# EasyEDA Pro project ProProject_Driver_STM32F031_2023-10-07.epro, board PCB1_3
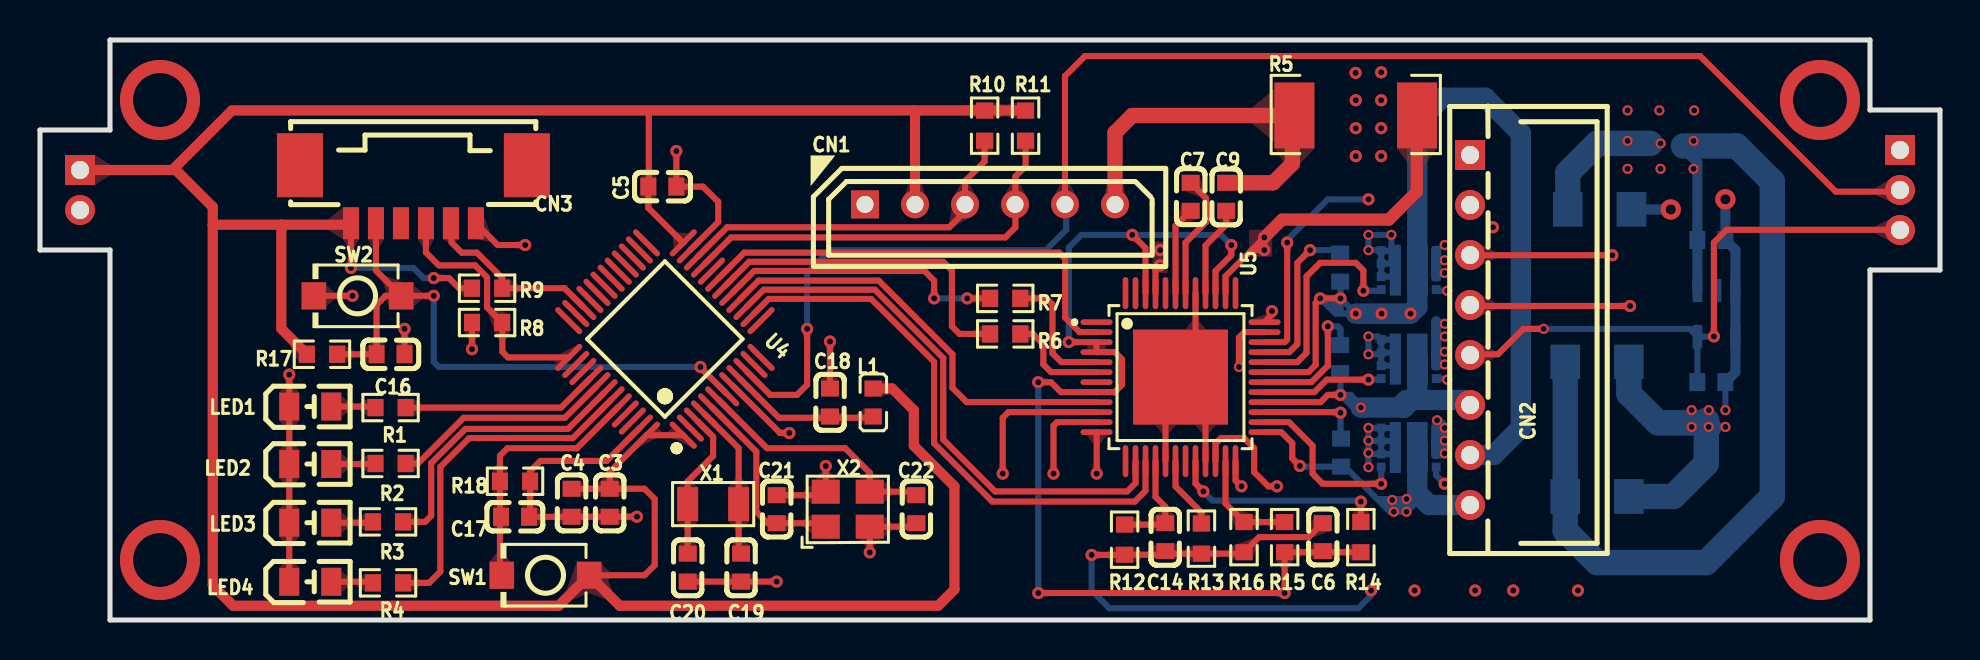
[diagram p10: board, top side]
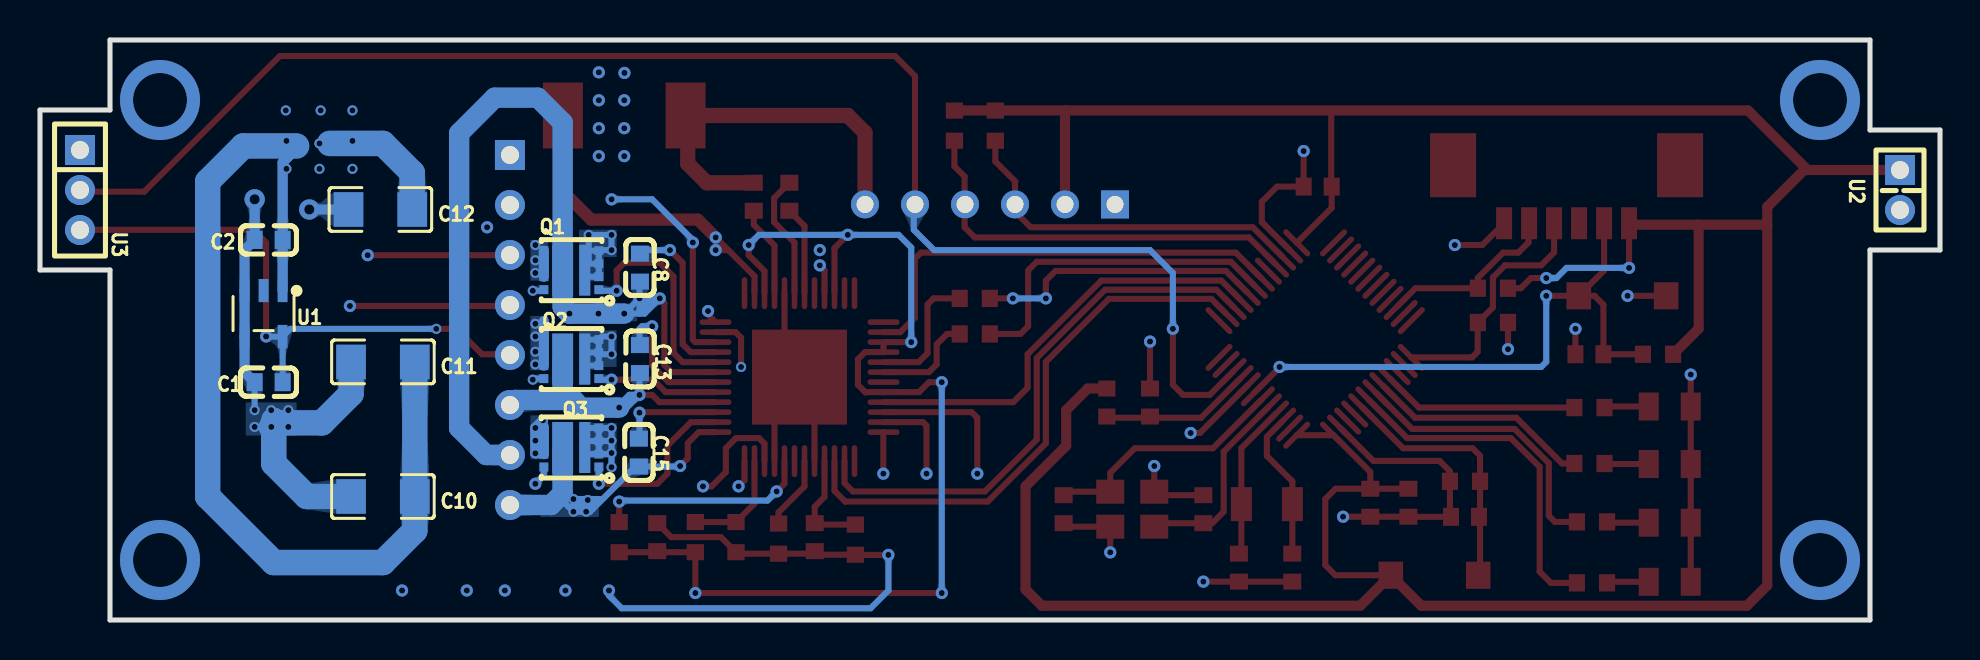
[diagram p11: board, bottom side, seen from below]

Outline 95 x 29 mm; copper layers: Top Layer, Inner1, Inner2, Bottom Layer. Coordinates in mm from the lower left corner of the outline.
Outline path: 0,24.5 0,18.5 3.5,18.5 3.5,0 91.5,0 91.5,17.5 95,17.5 95,25.5 91.5,25.5 91.5,29 3.5,29 3.5,24.5 0,24.5
Stack: Top Layer 0.035mm / Dielectric1 0.48mm PP er 4.5 / Inner1 0.035mm / Dielectric2 0.48mm FR4 er 4.5 / Inner2 0.035mm / Dielectric3 0.48mm PP er 4.5 / Bottom Layer 0.035mm

## Design rules (mm)
spacing safeClearance (default): track to track 0.152, other pairs 0.152 to 0.3
track width trackWidth (default): min 0.127, default 0.254, max 2.54
differential pair differentialPair (default): width min 0.127, default 0.254, max 2.54; gap min 0.152, default 0.152
via viaSize (default): diameter min 0.5, default 0.61, max 10; hole min 0.3, default 0.305, max 6
net GND uses copperRegion1
net VCC uses copperRegion1
net $1N6958 uses copperRegion1
net GND_CS uses copperRegion1
net +16V uses copperRegion1

## Placement (name value [footprint] x y rotation side)
C1  4.7uF  [C0603]  83.57 11.89 180 bottom
C2  10uF  [C0603]  83.57 19 180 bottom
C3  100nF  [C0603]  28.49 5.86 90 top
C4  100nF  [C0603]  26.58 5.86 90 top
C5  100nF  [C0603]  31.12 21.67 180 top
C6  1uF  [C0603]  64.14 4.14 270 top
C7  470nF  [C0603]  57.53 21.16 270 top
C8  33nF  [C0603]  65 17.62 270 bottom
C9  1uF  [C0603]  59.31 21.16 90 top
C10  10uF  [C1206]  77.85 6.17 180 bottom
C11  10uF  [C1206]  77.85 12.91 180 bottom
C12  10uF  [C1206]  77.98 20.53 180 bottom
C13  33nF  [C0603]  65 13.05 270 bottom
C14  1nF  [C0603]  56.26 4.14 90 top
C15  33nF  [C0603]  65.06 8.37 270 bottom
C16  100nF  [C0603]  17.53 13.29 180 top
C17  100nF  [C0603]  23.75 5.16 0 top
C18  100nF  [C0603]  39.5 10.87 270 top
C19  22pF  [c0603]  35.05 2.62 90 top
C20  22pF  [C0603]  32.39 2.62 90 top
C21  20pF  [c0603]  36.83 5.54 270 top
C22  20pF  [C0603]  43.82 5.54 270 top
CN1  HC-5264-6A  [CONN-TH_6P-P2.50_HCTL_HC-5264-6A]  47.5 20.78 0 top
CN2  HC-5264-8AW  [CONN-TH_8P-P2.50_HC-5264-8AW]  71.5 14.5 90 top
CN3  532610671  [CONN-SMD_6P-P1.25_53261-0671]  18.67 21.29 180 top
L1  3.3uH  [L0603]  41.66 10.87 270 top
LED1  SZYY0805B  [LED0805-R-RD_BLUE]  13.51 10.67 0 top
LED2  SZYY0805B  [LED0805-R-RD_BLUE]  13.51 7.8 0 top
LED3  SZYY0805B  [LED0805-R-RD_BLUE]  13.51 4.87 0 top
LED4  SZYY0805B  [LED0805-R-RD_BLUE]  13.51 1.91 0 top
Q1  DMT3009LDT-7  [V-DFN3030-8K_L3.0-W3.0-P0.65-BL]  68.43 17.49 90 bottom
Q2  DMT3009LDT-7  [V-DFN3030-8K_L3.0-W3.0-P0.65-BL]  68.43 13.05 90 bottom
Q3  DMT3009LDT-7  [V-DFN3030-8K_L3.0-W3.0-P0.65-BL]  68.43 8.62 90 bottom
R1  1kΩ  [R0603]  17.53 10.62 0 top
R2  1kΩ  [R0603]  17.53 7.83 0 top
R3  1kΩ  [R0603]  17.4 4.91 0 top
R4  1kΩ  [R0603]  17.4 1.86 0 top
R5  25mΩ  [RES-SMD_L6.4-W3.2-R2512]  65.79 25.22 0 top
R6  1kΩ  [R0603]  48.26 14.3 0 top
R7  1kΩ  [R0603]  48.26 16.08 0 top
R8  10kΩ  [R0603]  22.35 14.87 0 top
R9  10kΩ  [R0603]  22.35 16.59 0 top
R10  1kΩ  [R0603]  47.23 24.72 270 top
R11  1kΩ  [R0603]  49.28 24.72 270 top
R12  47kΩ  [R0603]  54.23 4.02 90 top
R13  10kΩ  [R0603]  58.07 4.07 270 top
R14  100kΩ  [R0603]  66.04 4.14 90 top
R15  100kΩ  [R0603]  62.23 4.14 90 top
R16  10kΩ  [R0603]  60.2 4.14 90 top
R17  10kΩ  [R0603]  14.1 13.29 180 top
R18  10kΩ  [R0603]  23.75 6.94 0 top
SW1  TS-1088-AR02016  [SW-SMD_L3.9-W3.0-P4.45]  25.28 2.24 180 top
SW2  TS-1088-AR02016  [SW-SMD_L3.9-W3.0-P4.45]  15.88 16.21 180 top
U1  TPS7B6950DBVR  [SOT-23-5_L3.0-W1.7-P0.95-LS2.8-BL]  83.82 15.32 0 bottom
U2  DW200R-11-02-43  [HDR-TH_2P-P2.00-V-F]  2 21.5 270 bottom
U3  PM200-1-03-Z-4.3  [HDR-TH_3P-P2.00-V-F-A]  93 21.5 270 bottom
U4  STM32F031C6T6TR  [LQFP-48_L7.0-W7.0-P0.50-LS9.0-TL]  31.24 14.05 135 top
U5  A3930KJPTR-T  [LQFP-48_L7.0-W7.0-P0.50-LS9.0-BL-EP]  57.03 12.14 270 top
X1  32.768kHz  [CRYSTAL-SMD_L3.2-W1.5-1]  33.66 5.79 180 top
X2  8MHz  [OSC-SMD_4P-L3.2-W2.5-BL]  40.39 5.54 0 top

## Footprints (pads in the part's own frame, mm; a bottom-side part is the same pattern mirrored in y, then rotated)
c0603
  rect 0.8x0.9 smd: 1(-0.7,0) 2(0.7,0)
C0603
  rect 0.8x0.9 smd: 1(-0.7,0) 2(0.7,0)
C1206
  rect 1.485x1.728 smd: 1(-1.593,0) 2(1.593,0)
CONN-SMD_6P-P1.25_53261-0671
  rect 0.8x1.6 smd: 1(3.124,1.45) 2(1.875,1.45) 3(0.625,1.45) 4(-0.625,1.45) 5(-1.875,1.45) 6(-3.124,1.45)
  rect 2.301x3.2 smd: 7(-5.675,-1.45) 8(5.675,-1.45)
CONN-TH_6P-P2.50_HCTL_HC-5264-6A
  rect 1.4x1.4 hole 0.85: 1(-6.25,0)
  round 1.4 hole 0.85: 2(-3.75,0) 3(-1.25,0) 4(1.25,0) 5(3.75,0) 6(6.25,0)
CONN-TH_8P-P2.50_HC-5264-8AW
  rect 1.5x1.5 hole 0.9: 1(8.75,0)
  round 1.5 hole 0.9: 2(6.25,0) 3(3.75,0) 4(1.25,0) 5(-1.25,0) 6(-3.75,0) 7(-6.25,0) 8(-8.75,0)
CRYSTAL-SMD_L3.2-W1.5-1
  rect 1.05x1.7 smd: 1(-1.275,0) 2(1.275,0)
HDR-TH_2P-P2.00-V-F
  rect 1.5x1.5 hole 0.9: 1(-1,0)
  round 1.5 hole 0.9: 2(1,0)
HDR-TH_3P-P2.00-V-F-A
  rect 1.5x1.5 hole 0.9: 1(-2,0)
  round 1.5 hole 0.9: 2(0,0) 3(2,0)
L0603
  rect 0.8x0.864 smd: 1(-0.7,0) 2(0.7,0)
LED0805-R-RD_BLUE
  rect 1.001x1.399 smd: 1(1.052,0) 2(-1.049,0)
LQFP-48_L7.0-W7.0-P0.50-LS9.0-BL-EP
  oval 0.28x1.6 smd: 1(-2.75,-4.2) 2(-2.25,-4.2) 3(-1.75,-4.2) 4(-1.25,-4.2) 5(-0.75,-4.2) 6(-0.25,-4.2) 7(0.25,-4.2) 8(0.75,-4.2) 9(1.25,-4.2) 10(1.75,-4.2) 11(2.25,-4.2) 12(2.75,-4.2) 25(2.75,4.2) 26(2.25,4.2) 27(1.75,4.2) 28(1.25,4.2) 29(0.75,4.2) 30(0.25,4.2) 31(-0.25,4.2) 32(-0.75,4.2) 33(-1.25,4.2) 34(-1.75,4.2) 35(-2.25,4.2) 36(-2.75,4.2)
  oval 1.6x0.28 smd: 13(4.2,-2.75) 14(4.2,-2.25) 15(4.2,-1.75) 16(4.2,-1.25) 17(4.2,-0.75) 18(4.2,-0.25) 19(4.2,0.25) 20(4.2,0.75) 21(4.2,1.25) 22(4.2,1.75) 23(4.2,2.25) 24(4.2,2.75) 37(-4.2,2.75) 38(-4.2,2.25) 39(-4.2,1.75) 40(-4.2,1.25) 41(-4.2,0.75) 42(-4.2,0.25) 43(-4.2,-0.25) 44(-4.2,-0.75) 45(-4.2,-1.25) 46(-4.2,-1.75) 47(-4.2,-2.25) 48(-4.2,-2.75)
  rect 4.75x4.75 smd: 49(0,0)
LQFP-48_L7.0-W7.0-P0.50-LS9.0-TL
  oval 1.8x0.28 smd: 1(-4.05,2.75) 2(-4.05,2.25) 3(-4.05,1.75) 4(-4.05,1.25) 5(-4.05,0.75) 6(-4.05,0.25) 7(-4.05,-0.25) 8(-4.05,-0.75) 9(-4.05,-1.25) 10(-4.05,-1.75) 11(-4.05,-2.25) 12(-4.05,-2.75) 25(4.05,-2.75) 26(4.05,-2.25) 27(4.05,-1.75) 28(4.05,-1.25) 29(4.05,-0.75) 30(4.05,-0.25) 31(4.05,0.25) 32(4.05,0.75) 33(4.05,1.25) 34(4.05,1.75) 35(4.05,2.25) 36(4.05,2.75)
  oval 0.28x1.8 smd: 13(-2.75,-4.05) 14(-2.25,-4.05) 15(-1.75,-4.05) 16(-1.25,-4.05) 17(-0.75,-4.05) 18(-0.25,-4.05) 19(0.25,-4.05) 20(0.75,-4.05) 21(1.25,-4.05) 22(1.75,-4.05) 23(2.25,-4.05) 24(2.75,-4.05) 37(2.75,4.05) 38(2.25,4.05) 39(1.75,4.05) 40(1.25,4.05) 41(0.75,4.05) 42(0.25,4.05) 43(-0.25,4.05) 44(-0.75,4.05) 45(-1.25,4.05) 46(-1.75,4.05) 47(-2.25,4.05) 48(-2.75,4.05)
OSC-SMD_4P-L3.2-W2.5-BL
  rect 1.4x1.2 smd: 1(-1.1,-0.875) 2(1.1,-0.875) 3(1.1,0.875) 4(-1.1,0.875)
R0603
  rect 0.806x0.864 smd: 1(-0.753,0) 2(0.753,0)
RES-SMD_L6.4-W3.2-R2512
  rect 2x3.3 smd: 1(-3.067,0) 2(3.067,0)
SOT-23-5_L3.0-W1.7-P0.95-LS2.8-BL
  rect 0.49x1.157 smd: 1(-0.95,-1.153) 2(0,-1.153) 3(0.95,-1.153)
  rect 0.49x1.175 smd: 4(0.95,1.153) 5(-0.95,1.153)
SW-SMD_L3.9-W3.0-P4.45
  rect 1.23x1.36 smd: 1(-2.185,0) 2(2.185,0)
V-DFN3030-8K_L3.0-W3.0-P0.65-BL
  rect 0.45x0.45 smd: 1(-0.975,-1.375) 2(-0.325,-1.375) 3(0.325,-1.375) 4(0.975,-1.375) 5(0.975,1.375) 6(0.325,1.375) 7(-0.325,1.375) 8(-0.975,1.375)
  rect 2.55x1.044 smd: 9(0,0.433)
  rect 2.55x0.556 smd: 10(0,-0.672)

## Nets
As in the schematic.

Pads without a net: CN3 3 7 8; U1 2; U4 2 11 20 25 26 27 28 29 30 31 32 33 35 36 38 39 45 46; U5 1 7 13 19 37 44 47 48

## Via types
v1: diameter 4, hole 2.7, Top Layer to Bottom Layer, 4 vias
v2: diameter 0.61, hole 0.305, Top Layer to Bottom Layer, 71 vias
v3: diameter 0.508, hole 0.3, Top Layer to Bottom Layer, 44 vias
v4: diameter 1.016, hole 0.508, Top Layer to Bottom Layer, 2 vias

## Routing (per net, layer and track width the routed paths; a pad name or vN(x,y) marks a point on that pad's centre or on a via; arc(x,y) is an arc through that point)
+5V: length 29.4
  Top Layer w0.305: 71.5,13.29 72.9,13.29 74.17,14.56 v3(75.19,14.56) ; 93,19.51 84.33,19.51 83.69,18.88 v2(83.69,14.18)
  Bottom Layer w0.305: C1.2 82.87,14.17 ; v2(83.69,14.18) 83.68,14.17 U1.5 82.48,14.56 v3(75.19,14.56)
+16V: length 80
  Top Layer w0.305: U5.24 59.78,6.98 v2(60.07,6.68) ; U5.45 55.78,17.5 v2(56.01,17.73)
  Inner2 w0.305: v3(66.42,14.18) v3(66.42,13.29)
  Bottom Layer w0.305: 67.06,18.46 67.03,18.49 v3(66.42,18.49) v3(66.42,19.26) v3(67.57,19.26) 67.57,18.46 ; 67.06,18.46 67.57,18.46 ; 67.06,18.46 Q1.3 ; 67.06,18.46 Q1.4 ; 66.42,8.3 Q3.2 ; 66.42,8.3 v3(66.42,8.35) 66.42,8.95 ; 66.42,8.3 v3(66.42,7.64) ; Q3.2 Q3.3 ; Q3.2 67.76,8.3 ; Q1.3 Q1.2 67.76,17.17 ; Q1.3 67.57,17.82 ; 67.06,14.02 Q2.4 67.06,14.02 ; 67.06,14.02 67.06,14.02 ; 67.06,14.02 66.9,14.18 v3(66.42,14.18) v3(66.42,13.29) 66.98,13.29 67.06,13.37 ; 67.06,14.02 Q2.3 ; 67.06,14.02 67.76,14.02 ; 66.42,8.95 Q3.3 ; 66.42,8.95 v3(66.42,8.97) v3(66.42,9.6) 66.43,9.6 Q3.4 ; Q3.3 Q3.4 ; Q3.3 67.76,8.95 ; 67.06,13.37 Q2.2 67.76,12.72 ; 67.06,13.37 Q2.3 ; 67.57,17.82 67.76,17.82 ; 67.57,17.82 67.57,18.46 ; 67.57,18.46 67.76,18.46 ; Q3.4 67.76,9.6 ; 67.71,13.37 67.76,13.32 67.76,13.05 ; 67.71,13.37 Q2.3 ; 67.71,13.37 67.76,13.37
  Bottom Layer w0.508: 82.3,23.45 82.87,22.88 C2.2 82.87,16.47
  Bottom Layer w1.27: 80.52,23.83 77.85,23.83 76.39,22.36 C12.2 ; C11.2 C10.2 76.26,4.47 77.85,2.87 83.31,2.87 86.62,6.17 86.62,21.92 84.84,23.7 82.17,23.7
  vias: v2(56.01,18.49) v3(79.38,25.48) v3(79.38,23.95) v3(79.38,22.56) v3(80.97,25.48) v3(81.03,23.83) v3(81.03,22.56) v3(82.71,25.48) v3(82.68,23.95) v3(82.68,22.56)
GND: length 143.3
  Top Layer w0.305: CN3.6 22.89,18.75 v2(24.26,18.75) ; v2(37.47,9.35) 37,9.35 U4.8 ; v2(36.83,1.92) C19.1 C20.1 ; C14.1 56.39,3.32 R13.2 60.2,3.32 ; 24.5,5.16 26.58,5.16 C4.1 C3.1 v2(29.85,5.16) ; 24.5,5.16 C17.2 ; 24.5,5.16 R18.2 24.5,7.44 25.02,7.95 28.33,7.95 U4.47 ; R16.1 60.95,4.14 63.44,4.14 C6.1 ; SW2.2 v2(15.62,16.21) ; v2(52.58,3.25) 54.22,3.25 R12.1 56.26,3.26 ; v2(12.46,12.27) LED1.2 LED2.2 LED3.2 LED4.2 ; v2(41.49,3.38) X2.2 43.82,4.67 ; C16.1 v2(18.23,14.56) ; U4.23 33.91,19.9 33.91,20.91 33.15,21.67 C5.1 v2(31.82,23.45) ; X2.4 v2(39.29,7.7) ; C21.1 39.29,6.24 ; U5.41 57.78,12.14 ; U5.21 58.28,12.14 ; U5.17 56.28,12.14 ; R8.1 v2(21.6,13.54) ; C18.1 v2(39.5,13.92)
  Top Layer w0.762: C9.2 61.66,21.86 62.61,22.81 62.61,25.22 ; 62.61,25.22 54.61,25.22 53.75,24.36 CN1.6 ; 62.61,25.22 R5.1
  Bottom Layer w0.305: v2(66.55,1.48) 66.55,1.22 65.91,0.59 53.47,0.59 52.58,1.48 v2(52.58,3.25) ; C1.1 v3(84.27,10.49)
  Bottom Layer w0.508: v4(84.27,21.03) C2.1 84.77,18.5 U1.3 U1.4 84.77,12.39 C1.1 ; v4(81.54,20.53) C12.1
  Bottom Layer w1.27: 83.31,9.78 v3(83.44,9.65) ; 83.31,9.78 83.23,9.86 80.9,9.86 79.45,11.31 C11.1 ; 83.31,9.78 83.31,7.83 81.66,6.17 C10.1 ; 83.31,9.78 83.31,9.98
  vias: v2(68.73,1.48) v2(71.76,1.48) v2(73.66,1.48) v2(76.9,1.48) v3(82.58,10.49) v3(82.58,9.65) v3(83.44,10.49) v3(84.27,9.65)
GND_CS: length 42.5
  Top Layer w0.305: 60.58,18.49 59.28,17.19 U5.38 ; 60.58,18.49 v2(61.22,18.49) v2(61.22,19.13) 60.58,18.49 ; v2(61.85,6.68) 61.42,6.68 60.71,7.39 60.71,8.59 60.2,9.1 59.05,9.1 58.78,8.82 U5.22
  Top Layer w0.61: v2(61.22,19.13) 62.1,20.02 67.44,20.02 68.84,21.42 68.84,25.22
  Inner1 w0.305: v2(61.85,6.68) 61.85,9.1 60.84,10.11 60.84,17.22 61.22,17.61 v2(61.22,18.49)
  Bottom Layer w0.508: 69.81,14.94 Q2.5 Q2.6 Q2.7 ; v3(69.85,9.98) v3(70.23,9.6) v3(70.23,8.97) v3(70.23,8.33) 69.84,8.33 Q3.7 Q3.6 Q3.5 ; Q1.7 Q1.6 Q1.5
  vias: v2(65.78,27.35) v2(65.79,25.99) v2(65.79,24.59) v2(65.79,23.19) v2(67.06,27.38) v2(67.06,25.99) v2(67.06,24.59) v2(67.06,23.19) v3(70.23,18.75) v3(70.23,17.99) v3(70.23,17.35) v3(70.23,14.81) v3(70.23,14.18) v3(70.23,13.41) v3(70.23,12.78)
VCC: length 172.7
  Top Layer w0.305: C3.2 28.49,7.4 U4.48 U4.1 ; C3.2 C4.2 ; C3.2 30.22,6.56 30.74,6.05 30.74,2.75 30.23,2.24 SW1.1 ; CN3.1 v2(15.55,17.61) ; v2(19.69,17.1) 20.45,17.1 20.96,16.59 R9.1 ; U4.24 30.42,20.6 C5.2 30.44,21.69 30.44,25.42
  Top Layer w0.508: R11.1 49.27,25.48 43.69,25.48 ; 12.07,19.76 12.07,14.57 R17.2 ; 12.07,19.76 8.64,19.76 ; 12.07,19.76 15.55,19.76 ; 43.69,25.48 43.75,25.42 CN1.2 ; 43.69,25.48 9.6,25.48 6.62,22.5 ; 8.64,19.76 8.64,20.65 6.79,22.5 6.62,22.5 ; 8.64,19.76 8.64,1.73 9.65,0.71 25.94,0.71 SW1.1 28.98,0.71 44.91,0.71 45.72,1.53 45.72,6.68 43.69,8.72 43.69,10.49 42.61,11.57 L1.1 ; 6.62,22.5 U2.1
  Bottom Layer w0.305: v2(19.69,17.1) 19.18,17.1 18.67,17.61 v2(15.55,17.61)
VDDA: length 7.5
  Top Layer w0.305: 41.66,10.11 36.95,10.11 34.99,12.07
(no net):
  vias: v1(6,26) v1(6,3) v1(89,26) v1(89,3)
32_IN: length 7.5
  Top Layer w0.305: U4.3 33.66,9.16 33.66,8.21 32.38,6.93 X1.2 32.38,3.32
32_OUT: length 7.7
  Top Layer w0.305: 34.93,3.32 X1.1 34.93,8.59 U4.4
BOOT0: length 12.9
  Top Layer w0.305: 23,2.24 23,5.11 C17.1 ; 28.91,10.66 26.84,8.59 23.37,8.59 23,8.22 R18.1 23,5.16
CA: length 8.3
  Top Layer w0.305: U5.33 62.47,13.39 62.87,13.8 62.87,17.86 v2(63.5,18.49)
  Bottom Layer w0.305: v2(63.5,18.49) 64.88,18.49 65,18.37
CB: length 7
  Top Layer w0.305: v2(64.39,14.68) 64.39,12.71 63.57,11.89 U5.30
  Bottom Layer w0.305: v2(64.39,14.68) 64.9,14.68 65.03,14.56 65.03,13.75
CC: length 5.1
  Top Layer w0.305: v2(65.03,10.37) 65,10.39 U5.27
  Bottom Layer w0.305: v2(65.03,10.37) 65.03,9.07
DIR: length 21.7
  Top Layer w0.305: 52.82,10.89 46.34,10.89 45.62,11.61 45.62,13.28 41.94,16.97 35.93,16.97 U4.16
FF1: length 16.8
  Top Layer w0.305: R6.1 45.98,14.3 45.59,14.68 45.59,17.48 45.16,17.91 35.46,17.91 U4.18
FF2: length 14.4
  Top Layer w0.305: v2(46.36,16.08) R7.1 ; U4.17 35.71,17.45 44.22,17.45 44.71,16.97 v2(44.71,16.08)
  Bottom Layer w0.305: v2(46.36,16.08) v2(44.71,16.08)
GHA: length 11.3
  Top Layer w0.305: U5.32 62.86,12.89 63.32,13.36 63.32,17.17 64.01,17.86 65.79,17.86 66.17,17.48 v2(66.17,16.46)
  Bottom Layer w0.305: v2(66.17,16.46) 67.06,16.46
GHB: length 6.1
  Top Layer w0.305: v2(66.42,12.02) 64.34,12.02 63.72,11.39 U5.29
  Bottom Layer w0.305: v2(66.42,12.02) 67.06,12.02
GHC: length 8.8
  Top Layer w0.305: v2(67.06,6.81) 64.14,6.81 63.63,7.32 63.63,8.72 62.45,9.89 U5.26
  Bottom Layer w0.305: v2(67.06,6.81) Q3.1
GLA: length 11.3
  Top Layer w0.305: v2(61.6,15.45) 61.6,15.27 U5.36
  Inner2 w0.305: v3(70.36,16.46) 67.95,16.46 67.31,17.1 62.74,17.1 61.6,15.95 v2(61.6,15.45)
  Bottom Layer w0.305: v3(70.36,16.46) 69.86,16.46 69.81,16.52
GLB: length 14.1
  Top Layer w0.305: U5.35 60.22,14.39 59.95,14.12 v3(59.95,12.65)
  Inner2 w0.305: v3(70.36,12.02) 68.58,12.02 67.95,12.65 v3(59.95,12.65)
  Bottom Layer w0.305: Q2.8 70.31,12.07 v3(70.36,12.02)
GLC: length 34.6
  Top Layer w0.305: v2(62.36,18.88) 62.36,14.02 62.23,13.89 U5.34
  Inner1 w0.305: v2(66.42,21.03) 68.07,21.03 69.47,19.64 v2(72.65,19.64)
  Inner2 w0.305: v2(70.23,6.81) 72.52,6.81 73.28,7.57 73.28,19 v2(72.65,19.64)
  Bottom Layer w0.305: v2(66.42,21.03) 64.39,21.03 62.36,19 v2(62.36,18.88) ; Q3.8 69.81,7.23 v2(70.23,6.81)
HA: length 68.1
  Top Layer w0.305: v2(79.5,15.7) 71.5,15.7 ; v2(48.13,7.32) 48.13,10.11 48.42,10.39 52.82,10.39
  Inner1 w0.305: v2(79.5,15.7) 79.5,1.09 79,0.59 48.9,0.59 48.13,1.35 v2(48.13,7.32)
HB: length 60
  Top Layer w0.305: v2(50.68,7.32) 50.68,9.72 50.85,9.89 52.82,9.89 ; v2(78.62,18.24) 71.5,18.24
  Inner1 w0.305: v2(78.62,18.24) 78.62,2.75 78.23,2.36 51.18,2.36 50.68,2.87 v2(50.68,7.32)
HC: length 48
  Top Layer w0.305: v2(52.83,7.32) 52.83,9.39 52.82,9.39
  Inner1 w0.305: v2(52.83,7.32) 52.83,4.65 53.47,4.02 75.06,4.02 75.95,4.91 75.95,19.38 74.58,20.75 CN2.2
I2C1_SCL: length 20.8
  Top Layer w0.305: U4.21 34.56,19.13 48.26,19.13 48.77,19.64 48.77,22.18 49.28,22.69 R11.2
I2C1_SDA: length 18.3
  Top Layer w0.305: U4.22 34.36,19.64 45.47,19.64 46.25,20.42 CN1.3 46.25,21.92 ; R10.2 47.23,22.93 46.23,21.92
IR_SIGNAL: length 75.7
  Top Layer w0.305: U4.10 36.51,11.25 37.85,11.25 38.36,11.76 v2(38.36,14.56) ; CN1.5 51.25,27.2 52.25,28.2 83.01,28.2 89.79,21.42 92.87,21.42
  Bottom Layer w0.305: v2(38.36,14.56) 38.36,17.35 39.5,18.49 50.29,18.49 51.31,19.51 51.31,20.78
LED1: length 9.8
  Top Layer w0.305: 27.5,12.07 26.05,10.62 R1.2
LED2: length 11.2
  Top Layer w0.305: R2.2 18.9,7.83 21.18,10.11 26.25,10.11 U4.41
LED3: length 14.3
  Top Layer w0.305: R3.2 19.25,4.91 19.56,5.21 19.56,7.84 21.27,9.55 26.39,9.55 U4.42
LED4: length 17.3
  Top Layer w0.305: R4.2 19.46,1.86 20.02,2.42 20.02,7.65 21.46,9.1 26.64,9.1 U4.43
MOTOR_MODE: length 28.2
  Top Layer w0.305: U5.15 55.28,6.46 54.74,5.92 47.62,5.92 44.71,8.83 44.71,12.91 41.56,16.06 36.43,16.06 U4.14
MOTOR_RESET: length 22.8
  Top Layer w0.305: 52.82,14.39 51.98,14.39 51.26,15.12 51.26,18.06 50.95,18.37 35.21,18.37 U4.19
NRST: length 30.2
  Top Layer w0.305: R17.1 C16.2 16.83,15.76 17.27,16.21 SW2.1 ; v2(19.69,16.21) SW2.1 ; SW2.1 16.8,17.47 CN3.2 ; v2(33.02,12.65) 33.02,12.62 U4.7
  Bottom Layer w0.305: v2(19.69,16.21) 19.69,12.91 19.94,12.65 v2(33.02,12.65)
OSC_IN: length 9.9
  Top Layer w0.305: 33.58,10.66 35.82,8.42 35.82,5.41 36.39,4.84 C21.2 39.29,4.84
OSC_OUT: length 12.3
  Top Layer w0.305: 43.82,6.42 X2.3 41.49,7.36 40.26,8.59 36.35,8.59 U4.6
PWM: length 27.6
  Top Layer w0.305: U5.14 54.78,6.85 54.36,6.43 47.75,6.43 45.16,9.02 45.16,13.1 41.75,16.51 36.18,16.51 U4.15
SWCLK: length 12.5
  Top Layer w0.305: 23.12,14.87 23.12,13.41 23.4,13.13 U4.37 ; R8.2 22.35,15.63 22.35,17.13 21.75,17.73 19.94,17.73 19.3,18.38 CN3.4
SWDIO: length 9.2
  Top Layer w0.305: U4.34 26.23,16.59 R9.2 23.11,17.11 21.85,18.37 21.08,18.37 20.58,18.88 20.58,19.84
U: length 20.2
  Top Layer w0.305: U5.25 62.06,9.39 62.61,8.84 62.61,8.08 v2(62.99,7.7)
  Bottom Layer w0.305: 67.88,6.05 67.88,5.41 ; 67.88,6.05 68.07,6.05 ; 67.88,6.05 67.59,6.05 ; 67.88,5.41 v3(68.33,5.41) 68.58,5.67 ; 67.88,5.41 67.5,5.41 ; 67.35,6.05 67.35,5.57 67.35,5.56 ; 67.35,6.05 66.99,6.05 ; 67.35,6.05 67.59,6.05 ; 68.07,6.05 68.07,5.67 68.58,5.67 ; 68.07,6.05 v3(68.33,6.05) 68.61,6.33 68.87,6.33 68.87,5.95 68.58,5.67 ; 67.35,5.56 67.5,5.41 ; 67.35,5.56 65.24,7.67 62.99,7.67 ; 67.5,5.41 67.59,5.5 67.59,6.05
  Bottom Layer w1.016: CN2.8 69.45,5.75 68.87,6.33 Q3.9
  vias: v3(67.61,6) v3(67.69,5.41)
V: length 50.4
  Top Layer w0.305: v2(65.03,16.08) v2(64.01,16.08) 63.78,15.85 63.78,12.75 63.42,12.39 U5.31
  Bottom Layer w0.305: 65.03,15.32 v2(65.79,15.32) v2(65.03,16.08) ; 65.03,15.32 64.77,15.32 v2(64.01,16.08) 64.43,16.08 ; 65.03,15.32 65.03,15.48 ; 64.43,16.08 65.03,15.48 ; 64.43,16.08 v2(65.03,16.08) ; 65.03,15.48 v2(65.03,16.08) ; v2(65.03,16.08) 65.03,16.82 65,16.84
  Bottom Layer w1.016: v2(65.79,15.32) v2(67.08,15.32) v2(68.53,15.32) 68.87,15.66 Q1.9 68.87,24.87 70.11,26.11 72.26,26.11 74.04,24.34 74.04,9.6 72.69,8.25 CN2.7
W: length 17
  Top Layer w0.305: v2(65.03,11.25) 64.39,11.25 64.03,10.89 U5.28
  Bottom Layer w0.305: 66.17,10.62 65.53,11.25 ; 65.53,11.25 v2(65.03,11.25) ; 65.53,11.25 65.53,11 65.91,10.62 65.66,10.62 v2(65.03,11.25) ; v2(65.03,11.25) 65.03,12.35
  Bottom Layer w1.016: CN2.6 71.25,11 68.58,11 ; 68.2,10.62 68.58,11 ; 68.2,10.62 68.2,10.87 68.33,11 68.58,11 ; 68.2,10.62 v3(66.04,10.62) ; 68.58,11 68.87,11.29 68.87,13.05
$1N6930: length 4.4
  Top Layer w0.305: U5.43 56.78,19.7 C7.2
$1N6936: length 4.5
  Top Layer w0.305: C9.1 59.31,19.76 58.28,18.73 U5.40
$1N6937: length 6.3
  Top Layer w0.305: U5.42 57.28,18.87 58.29,19.89 58.29,21.1 C7.1
$1N6938: length 10.8
  Top Layer w0.305: U5.20 57.78,6.82 v2(58.17,6.43) ; v2(66.04,5.92) R14.2
  Bottom Layer w0.305: v2(58.17,6.43) 58.62,5.97 65.99,5.97 v2(66.04,5.92)
$1N6939: length 5.3
  Top Layer w0.305: U5.16 55.78,6.16 56.26,5.67 C14.2 ; R12.2 56.26,4.77
$1N6940: length 5.5
  Top Layer w0.305: R15.2 R16.2 59.28,5.82 U5.23
$1N6942: length 3.7
  Top Layer w0.305: U5.18 56.78,6.68 58.07,5.38 R13.1
$1N6958: length 57.1
  Top Layer w0.305: U5.46 55.28,18.59 v2(54.61,19.26) ; R14.1 64.19,3.39 C6.2 ; U5.39 58.78,17.45 59.56,18.24 v2(59.56,18.75) ; v2(51.44,13.89) 52.82,13.89 52.82,13.39 53.74,13.39 54.1,13.03 54.1,11.76 53.72,11.38 53.71,11.39 51.04,11.39 50.55,11.89 v2(49.91,11.89) ; v2(49.91,1.35) v2(62.23,1.35) R15.1 64.14,3.39
  Bottom Layer w0.305: v2(59.56,18.75) 59.06,19.26 v2(54.61,19.26) 52.07,19.26 51.44,18.62 v2(51.44,13.89) ; v2(49.91,1.35) v2(49.91,11.89)
$1N6995: length 2.2
  Top Layer w0.305: LED1.1 16.77,10.67
$1N6998: length 2.2
  Top Layer w0.305: LED2.1 16.77,7.8
$1N7001: length 2.1
  Top Layer w0.305: LED3.1 16.65,4.87
$1N7004: length 2.1
  Top Layer w0.305: LED4.1 16.65,1.91
$1N51447: length 5.2
  Top Layer w0.305: 52.82,12.39 50.55,12.39 50.17,12.78 50.17,13.78 49.65,14.3 R6.2
$1N51449: length 6.6
  Top Layer w0.305: 52.82,12.89 51.07,12.89 50.62,13.34 50.62,15.78 50.32,16.08 R7.2

## Copper pours and planes (outline as drawn; the poured copper is in the pictures)
+16V on Top Layer: 55.63,18.93 56.39,18.93 56.39,17.35 55.63,17.35
+16V on Bottom Layer: 66.17,19.51 68.04,19.51 68.04,18.16 66.17,18.16
+16V on Bottom Layer: 78.87,25.86 83.19,25.86 83.19,22.18 78.87,22.18
+16V on Bottom Layer: 66.17,9.84 67.76,9.84 67.76,8.17 66.17,8.17
+16V on Bottom Layer: 66.17,14.48 68.05,14.48 68.05,12.65 66.17,12.65
+16V on Bottom Layer: 66.8,18.62 68.04,18.62 68.04,16.94 66.8,16.94
+16V on Inner2: 38.36,36.66 93.73,36.66 93.73,-7.03 38.36,-7.03
+16V on Inner2: 55.63,18.87 56.39,18.87 56.39,17.35 55.63,17.35
GND on Bottom Layer: 82.17,10.87 84.71,10.87 84.71,9.22 82.17,9.22
GND on Inner1: -9.65,31.96 97.54,31.96 97.54,-5.38 -9.65,-5.38
GND_CS on Top Layer: 60.45,19.51 61.61,19.51 61.61,18.17 60.45,18.17
GND_CS on Top Layer: 65.41,27.64 70.4,27.64 70.4,22.81 65.41,22.81
GND_CS on Bottom Layer: 69.6,19 70.49,19 70.49,16.97 69.6,16.97
GND_CS on Bottom Layer: 69.59,15.2 70.48,15.2 70.48,12.49 69.59,12.49
GND_CS on Bottom Layer: 69.6,10.24 70.49,10.24 70.49,8.04 69.6,8.04
GND_CS on Inner1: 65.41,27.64 70.4,27.64 70.4,7.32 65.41,7.32
VCC on Inner2: -4.95,35 36.83,35 36.83,-2.46 -4.95,-2.46
U on Bottom Layer: 67.06,6.21 69.98,6.21 69.98,5.16 67.06,5.16
V on Bottom Layer: 65.15,15.83 67.31,15.83 67.31,14.94 65.15,14.94

Small or netless copper shapes (teardrops, artwork), in the pictures only: 208 on Top Layer, 148 on Bottom Layer, 10 on Inner1, 8 on Inner2
